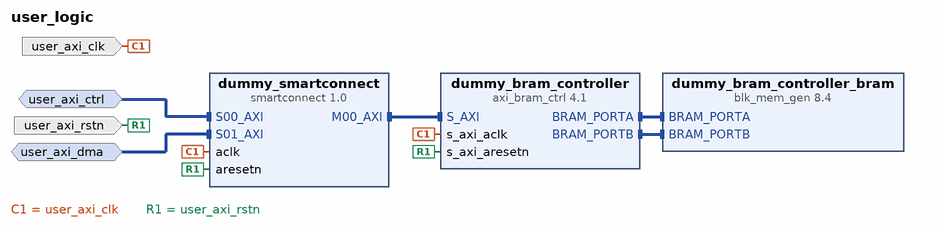
[diagram p0: block diagram of the top level]
# Vivado block design user_logic, xcu55n-fsvh2892-2L-e, Vivado 2022.2
create_bd_design user_logic

create_bd_intf_port -mode Slave -vlnv xilinx.com:interface:aximm_rtl:1.0 user_axi_ctrl
set_property -dict [list \
  CONFIG.ADDR_WIDTH 32 \
  CONFIG.ARUSER_WIDTH 0 \
  CONFIG.AWUSER_WIDTH 0 \
  CONFIG.BUSER_WIDTH 0 \
  CONFIG.DATA_WIDTH 32 \
  CONFIG.FREQ_HZ 250000000 \
  CONFIG.HAS_BRESP 1 \
  CONFIG.HAS_BURST 0 \
  CONFIG.HAS_CACHE 0 \
  CONFIG.HAS_LOCK 0 \
  CONFIG.HAS_PROT 0 \
  CONFIG.HAS_QOS 0 \
  CONFIG.HAS_REGION 0 \
  CONFIG.HAS_RRESP 1 \
  CONFIG.HAS_WSTRB 1 \
  CONFIG.ID_WIDTH 0 \
  CONFIG.MAX_BURST_LENGTH 1 \
  CONFIG.NUM_READ_OUTSTANDING 1 \
  CONFIG.NUM_READ_THREADS 1 \
  CONFIG.NUM_WRITE_OUTSTANDING 1 \
  CONFIG.NUM_WRITE_THREADS 1 \
  CONFIG.PROTOCOL AXI4LITE \
  CONFIG.READ_WRITE_MODE READ_WRITE \
  CONFIG.RUSER_BITS_PER_BYTE 0 \
  CONFIG.RUSER_WIDTH 0 \
  CONFIG.SUPPORTS_NARROW_BURST 0 \
  CONFIG.WUSER_BITS_PER_BYTE 0 \
  CONFIG.WUSER_WIDTH 0 \
  CONFIG.master_id 1 \
] [get_bd_intf_ports user_axi_ctrl]
create_bd_intf_port -mode Slave -vlnv xilinx.com:interface:aximm_rtl:1.0 user_axi_dma
set_property -dict [list \
  CONFIG.ADDR_WIDTH 64 \
  CONFIG.ARUSER_WIDTH 0 \
  CONFIG.AWUSER_WIDTH 0 \
  CONFIG.BUSER_WIDTH 0 \
  CONFIG.DATA_WIDTH 128 \
  CONFIG.FREQ_HZ 250000000 \
  CONFIG.HAS_BRESP 1 \
  CONFIG.HAS_BURST 0 \
  CONFIG.HAS_CACHE 0 \
  CONFIG.HAS_LOCK 0 \
  CONFIG.HAS_PROT 0 \
  CONFIG.HAS_QOS 0 \
  CONFIG.HAS_REGION 0 \
  CONFIG.HAS_RRESP 1 \
  CONFIG.HAS_WSTRB 1 \
  CONFIG.ID_WIDTH 0 \
  CONFIG.MAX_BURST_LENGTH 256 \
  CONFIG.NUM_READ_OUTSTANDING 32 \
  CONFIG.NUM_READ_THREADS 1 \
  CONFIG.NUM_WRITE_OUTSTANDING 32 \
  CONFIG.NUM_WRITE_THREADS 1 \
  CONFIG.PROTOCOL AXI4 \
  CONFIG.READ_WRITE_MODE READ_WRITE \
  CONFIG.RUSER_BITS_PER_BYTE 0 \
  CONFIG.RUSER_WIDTH 0 \
  CONFIG.SUPPORTS_NARROW_BURST 0 \
  CONFIG.WUSER_BITS_PER_BYTE 0 \
  CONFIG.WUSER_WIDTH 0 \
  CONFIG.master_id 2 \
] [get_bd_intf_ports user_axi_dma]
create_bd_port -dir I -type clk user_axi_clk
set_property -dict [list \
  CONFIG.ASSOCIATED_BUSIF user_axi_ctrl:user_axi_dma \
  CONFIG.ASSOCIATED_RESET user_axi_rstn \
  CONFIG.FREQ_HZ 250000000 \
] [get_bd_ports user_axi_clk]
create_bd_port -dir I -type rst user_axi_rstn

create_bd_cell -type ip -vlnv xilinx.com:ip:smartconnect:1.0 dummy_smartconnect
create_bd_cell -type ip -vlnv xilinx.com:ip:axi_bram_ctrl:4.1 dummy_bram_controller
create_bd_cell -type ip -vlnv xilinx.com:ip:blk_mem_gen:8.4 dummy_bram_controller_bram
set_property -dict {CONFIG.Memory_Type True_Dual_Port_RAM} [get_bd_cells dummy_bram_controller_bram]

# ---- connections ----

connect_bd_intf_net [get_bd_intf_pins dummy_bram_controller_bram/BRAM_PORTA] [get_bd_intf_pins dummy_bram_controller/BRAM_PORTA]
connect_bd_intf_net [get_bd_intf_pins dummy_bram_controller_bram/BRAM_PORTB] [get_bd_intf_pins dummy_bram_controller/BRAM_PORTB]
connect_bd_intf_net [get_bd_intf_pins dummy_bram_controller/S_AXI] [get_bd_intf_pins dummy_smartconnect/M00_AXI]
connect_bd_intf_net [get_bd_intf_ports user_axi_ctrl] [get_bd_intf_pins dummy_smartconnect/S00_AXI]
connect_bd_intf_net [get_bd_intf_ports user_axi_dma] [get_bd_intf_pins dummy_smartconnect/S01_AXI]
connect_bd_net [get_bd_ports user_axi_clk] [get_bd_pins dummy_smartconnect/aclk] [get_bd_pins dummy_bram_controller/s_axi_aclk]
connect_bd_net [get_bd_ports user_axi_rstn] [get_bd_pins dummy_smartconnect/aresetn] [get_bd_pins dummy_bram_controller/s_axi_aresetn]

# ---- address map ----
assign_bd_address -offset 0x04000000 -range 32K -target_address_space [get_bd_addr_spaces user_axi_ctrl] [get_bd_addr_segs dummy_bram_controller/S_AXI/Mem0]
assign_bd_address -offset 0x0000000000000000 -range 32K -target_address_space [get_bd_addr_spaces user_axi_dma] [get_bd_addr_segs dummy_bram_controller/S_AXI/Mem0]

validate_bd_design
save_bd_design
